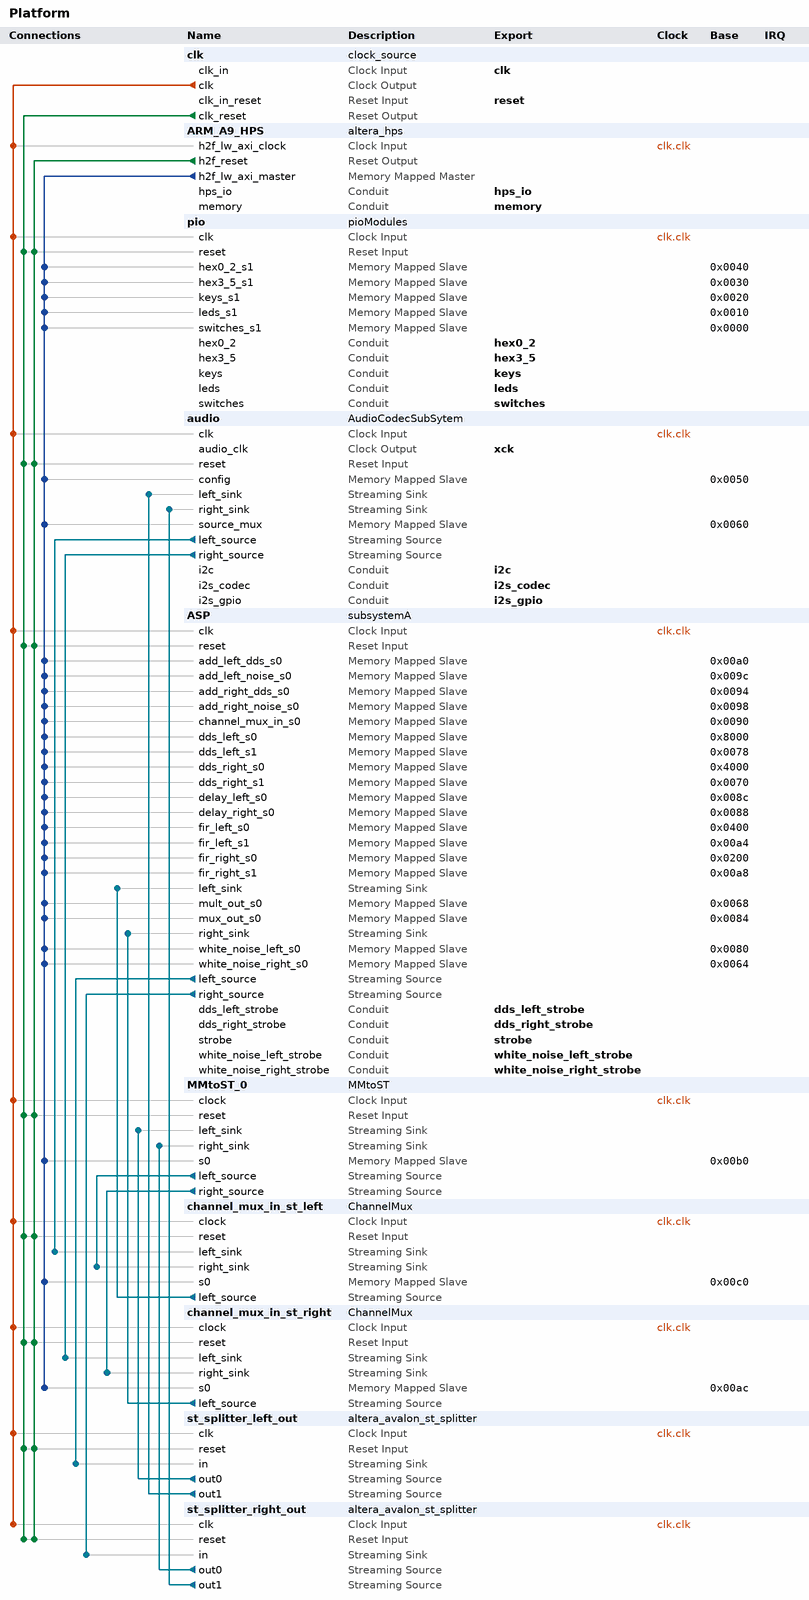
[diagram p0: system contents]
# Platform Designer (Qsys) system Platform, Cyclone V 5CSEMA5F31C6
# Parameters at their usual value, and those the tool derives, are not listed.
package require -exact qsys 17.1
create_system Platform
set_project_property DEVICE_FAMILY {Cyclone V}
set_project_property DEVICE 5CSEMA5F31C6

add_instance clk clock_source 17.1
set_instance_parameter_value clk clockFrequency 50000000

add_instance ARM_A9_HPS altera_hps 17.1
set_instance_parameter_value ARM_A9_HPS EMAC1_Mode RGMII
set_instance_parameter_value ARM_A9_HPS EMAC1_PinMuxing {HPS I/O Set 0}
set_instance_parameter_value ARM_A9_HPS F2SCLK_COLDRST_Enable false
set_instance_parameter_value ARM_A9_HPS F2SCLK_DBGRST_Enable false
set_instance_parameter_value ARM_A9_HPS F2SCLK_WARMRST_Enable false
set_instance_parameter_value ARM_A9_HPS F2SINTERRUPT_Enable false
set_instance_parameter_value ARM_A9_HPS F2S_Width 0
set_instance_parameter_value ARM_A9_HPS FPGA_PERIPHERAL_OUTPUT_CLOCK_FREQ_EMAC0_GTX_CLK 125
set_instance_parameter_value ARM_A9_HPS FPGA_PERIPHERAL_OUTPUT_CLOCK_FREQ_EMAC0_MD_CLK 2.5
set_instance_parameter_value ARM_A9_HPS FPGA_PERIPHERAL_OUTPUT_CLOCK_FREQ_EMAC1_GTX_CLK 125
set_instance_parameter_value ARM_A9_HPS FPGA_PERIPHERAL_OUTPUT_CLOCK_FREQ_EMAC1_MD_CLK 2.5
set_instance_parameter_value ARM_A9_HPS HPS_PROTOCOL DDR3
set_instance_parameter_value ARM_A9_HPS I2C0_Mode I2C
set_instance_parameter_value ARM_A9_HPS I2C0_PinMuxing {HPS I/O Set 0}
set_instance_parameter_value ARM_A9_HPS I2C1_Mode I2C
set_instance_parameter_value ARM_A9_HPS I2C1_PinMuxing {HPS I/O Set 0}
set_instance_parameter_value ARM_A9_HPS LWH2F_Enable true
set_instance_parameter_value ARM_A9_HPS MEM_BANKADDR_WIDTH 3
set_instance_parameter_value ARM_A9_HPS MEM_CLK_FREQ 400.0
set_instance_parameter_value ARM_A9_HPS MEM_COL_ADDR_WIDTH 10
set_instance_parameter_value ARM_A9_HPS MEM_DQ_WIDTH 32
set_instance_parameter_value ARM_A9_HPS MEM_DRV_STR RZQ/7
set_instance_parameter_value ARM_A9_HPS MEM_ROW_ADDR_WIDTH 15
set_instance_parameter_value ARM_A9_HPS MEM_RTT_NOM RZQ/4
set_instance_parameter_value ARM_A9_HPS MEM_RTT_WR RZQ/4
set_instance_parameter_value ARM_A9_HPS MEM_TCL 11
set_instance_parameter_value ARM_A9_HPS MEM_TFAW_NS 30.0
set_instance_parameter_value ARM_A9_HPS MEM_TRAS_NS 35.0
set_instance_parameter_value ARM_A9_HPS MEM_TRCD_NS 13.75
set_instance_parameter_value ARM_A9_HPS MEM_TRFC_NS 260.0
set_instance_parameter_value ARM_A9_HPS MEM_TRP_NS 13.75
set_instance_parameter_value ARM_A9_HPS MEM_VENDOR JEDEC
set_instance_parameter_value ARM_A9_HPS MEM_WTCL 8
set_instance_parameter_value ARM_A9_HPS QSPI_Mode {1 SS}
set_instance_parameter_value ARM_A9_HPS QSPI_PinMuxing {HPS I/O Set 0}
set_instance_parameter_value ARM_A9_HPS REF_CLK_FREQ 25.0
set_instance_parameter_value ARM_A9_HPS S2FCLK_USER2CLK 5
set_instance_parameter_value ARM_A9_HPS S2F_Width 0
set_instance_parameter_value ARM_A9_HPS SDIO_Mode {4-bit Data}
set_instance_parameter_value ARM_A9_HPS SDIO_PinMuxing {HPS I/O Set 0}
set_instance_parameter_value ARM_A9_HPS SPIM1_Mode {Single Slave Select}
set_instance_parameter_value ARM_A9_HPS SPIM1_PinMuxing {HPS I/O Set 0}
set_instance_parameter_value ARM_A9_HPS STM_Enable false
set_instance_parameter_value ARM_A9_HPS TIMING_BOARD_AC_SKEW 0.03
set_instance_parameter_value ARM_A9_HPS TIMING_BOARD_AC_TO_CK_SKEW 0.0
set_instance_parameter_value ARM_A9_HPS TIMING_BOARD_DQ_TO_DQS_SKEW 0.0
set_instance_parameter_value ARM_A9_HPS TIMING_BOARD_MAX_CK_DELAY 0.3
set_instance_parameter_value ARM_A9_HPS TIMING_BOARD_MAX_DQS_DELAY 0.02
set_instance_parameter_value ARM_A9_HPS TIMING_BOARD_SKEW_BETWEEN_DQS 0.08
set_instance_parameter_value ARM_A9_HPS TIMING_BOARD_SKEW_CKDQS_DIMM_MAX 0.16
set_instance_parameter_value ARM_A9_HPS TIMING_BOARD_SKEW_CKDQS_DIMM_MIN 0.09
set_instance_parameter_value ARM_A9_HPS TIMING_BOARD_SKEW_WITHIN_DQS 0.01
set_instance_parameter_value ARM_A9_HPS TIMING_TDH 65
set_instance_parameter_value ARM_A9_HPS TIMING_TDQSCK 255
set_instance_parameter_value ARM_A9_HPS TIMING_TDQSQ 125
set_instance_parameter_value ARM_A9_HPS TIMING_TDS 30
set_instance_parameter_value ARM_A9_HPS TIMING_TIH 140
set_instance_parameter_value ARM_A9_HPS TIMING_TIS 180
set_instance_parameter_value ARM_A9_HPS TIMING_TQSH 0.4
set_instance_parameter_value ARM_A9_HPS UART0_Mode {No Flow Control}
set_instance_parameter_value ARM_A9_HPS UART0_PinMuxing {HPS I/O Set 0}
set_instance_parameter_value ARM_A9_HPS USB1_Mode SDR
set_instance_parameter_value ARM_A9_HPS USB1_PinMuxing {HPS I/O Set 0}
set_instance_parameter_value ARM_A9_HPS desired_cfg_clk_mhz 100.0
set_instance_parameter_value ARM_A9_HPS desired_qspi_clk_mhz 400.0
set_instance_parameter_value ARM_A9_HPS use_default_mpu_clk false

add_instance pio pioModules 1.0

add_instance audio AudioCodecSubSytem 1.0

add_instance ASP subsystemA 1.0

add_instance MMtoST_0 MMtoST 1.0
set_instance_parameter_value MMtoST_0 data_width_g 24
set_instance_parameter_value MMtoST_0 fifo_adr_width_g 8
set_instance_parameter_value MMtoST_0 fifo_depth_g 128

add_instance channel_mux_in_st_left ChannelMux 1.0
set_instance_parameter_value channel_mux_in_st_left gDataWidth 24

add_instance channel_mux_in_st_right ChannelMux 1.0
set_instance_parameter_value channel_mux_in_st_right gDataWidth 24

add_instance st_splitter_left_out altera_avalon_st_splitter 17.1
set_instance_parameter_value st_splitter_left_out BITS_PER_SYMBOL 8
set_instance_parameter_value st_splitter_left_out CHANNEL_WIDTH 1
set_instance_parameter_value st_splitter_left_out DATA_WIDTH 24
set_instance_parameter_value st_splitter_left_out ERROR_WIDTH 1
set_instance_parameter_value st_splitter_left_out MAX_CHANNELS 1
set_instance_parameter_value st_splitter_left_out NUMBER_OF_OUTPUTS 2
set_instance_parameter_value st_splitter_left_out QUALIFY_VALID_OUT 0
set_instance_parameter_value st_splitter_left_out READY_LATENCY 0
set_instance_parameter_value st_splitter_left_out USE_CHANNEL 0
set_instance_parameter_value st_splitter_left_out USE_DATA 1
set_instance_parameter_value st_splitter_left_out USE_ERROR 0
set_instance_parameter_value st_splitter_left_out USE_PACKETS 0
set_instance_parameter_value st_splitter_left_out USE_READY 0
set_instance_parameter_value st_splitter_left_out USE_VALID 1

add_instance st_splitter_right_out altera_avalon_st_splitter 17.1
set_instance_parameter_value st_splitter_right_out BITS_PER_SYMBOL 8
set_instance_parameter_value st_splitter_right_out CHANNEL_WIDTH 1
set_instance_parameter_value st_splitter_right_out DATA_WIDTH 24
set_instance_parameter_value st_splitter_right_out ERROR_WIDTH 1
set_instance_parameter_value st_splitter_right_out MAX_CHANNELS 1
set_instance_parameter_value st_splitter_right_out NUMBER_OF_OUTPUTS 2
set_instance_parameter_value st_splitter_right_out QUALIFY_VALID_OUT 0
set_instance_parameter_value st_splitter_right_out READY_LATENCY 0
set_instance_parameter_value st_splitter_right_out USE_CHANNEL 0
set_instance_parameter_value st_splitter_right_out USE_DATA 1
set_instance_parameter_value st_splitter_right_out USE_ERROR 0
set_instance_parameter_value st_splitter_right_out USE_PACKETS 0
set_instance_parameter_value st_splitter_right_out USE_READY 0
set_instance_parameter_value st_splitter_right_out USE_VALID 1

# connections
add_connection clk.clk ARM_A9_HPS.h2f_lw_axi_clock clock
add_connection clk.clk ASP.clk clock
add_connection clk.clk audio.clk clock
add_connection clk.clk channel_mux_in_st_left.clock clock
add_connection clk.clk channel_mux_in_st_right.clock clock
add_connection clk.clk MMtoST_0.clock clock
add_connection clk.clk pio.clk clock
add_connection clk.clk st_splitter_left_out.clk clock
add_connection clk.clk st_splitter_right_out.clk clock
add_connection ARM_A9_HPS.h2f_reset ASP.reset reset
add_connection ARM_A9_HPS.h2f_reset audio.reset reset
add_connection ARM_A9_HPS.h2f_reset channel_mux_in_st_left.reset reset
add_connection ARM_A9_HPS.h2f_reset channel_mux_in_st_right.reset reset
add_connection ARM_A9_HPS.h2f_reset MMtoST_0.reset reset
add_connection ARM_A9_HPS.h2f_reset pio.reset reset
add_connection ARM_A9_HPS.h2f_reset st_splitter_left_out.reset reset
add_connection ARM_A9_HPS.h2f_reset st_splitter_right_out.reset reset
add_connection clk.clk_reset ASP.reset reset
add_connection clk.clk_reset audio.reset reset
add_connection clk.clk_reset channel_mux_in_st_left.reset reset
add_connection clk.clk_reset channel_mux_in_st_right.reset reset
add_connection clk.clk_reset MMtoST_0.reset reset
add_connection clk.clk_reset pio.reset reset
add_connection clk.clk_reset st_splitter_left_out.reset reset
add_connection clk.clk_reset st_splitter_right_out.reset reset
add_connection ARM_A9_HPS.h2f_lw_axi_master ASP.add_left_dds_s0 avalon
set_connection_parameter_value ARM_A9_HPS.h2f_lw_axi_master/ASP.add_left_dds_s0 baseAddress 0x00a0
add_connection ARM_A9_HPS.h2f_lw_axi_master ASP.add_left_noise_s0 avalon
set_connection_parameter_value ARM_A9_HPS.h2f_lw_axi_master/ASP.add_left_noise_s0 baseAddress 0x009c
add_connection ARM_A9_HPS.h2f_lw_axi_master ASP.add_right_dds_s0 avalon
set_connection_parameter_value ARM_A9_HPS.h2f_lw_axi_master/ASP.add_right_dds_s0 baseAddress 0x0094
add_connection ARM_A9_HPS.h2f_lw_axi_master ASP.add_right_noise_s0 avalon
set_connection_parameter_value ARM_A9_HPS.h2f_lw_axi_master/ASP.add_right_noise_s0 baseAddress 0x0098
add_connection ARM_A9_HPS.h2f_lw_axi_master ASP.channel_mux_in_s0 avalon
set_connection_parameter_value ARM_A9_HPS.h2f_lw_axi_master/ASP.channel_mux_in_s0 baseAddress 0x0090
add_connection ARM_A9_HPS.h2f_lw_axi_master ASP.dds_left_s0 avalon
set_connection_parameter_value ARM_A9_HPS.h2f_lw_axi_master/ASP.dds_left_s0 baseAddress 0x8000
add_connection ARM_A9_HPS.h2f_lw_axi_master ASP.dds_left_s1 avalon
set_connection_parameter_value ARM_A9_HPS.h2f_lw_axi_master/ASP.dds_left_s1 baseAddress 0x0078
add_connection ARM_A9_HPS.h2f_lw_axi_master ASP.dds_right_s0 avalon
set_connection_parameter_value ARM_A9_HPS.h2f_lw_axi_master/ASP.dds_right_s0 baseAddress 0x4000
add_connection ARM_A9_HPS.h2f_lw_axi_master ASP.dds_right_s1 avalon
set_connection_parameter_value ARM_A9_HPS.h2f_lw_axi_master/ASP.dds_right_s1 baseAddress 0x0070
add_connection ARM_A9_HPS.h2f_lw_axi_master ASP.delay_left_s0 avalon
set_connection_parameter_value ARM_A9_HPS.h2f_lw_axi_master/ASP.delay_left_s0 baseAddress 0x008c
add_connection ARM_A9_HPS.h2f_lw_axi_master ASP.delay_right_s0 avalon
set_connection_parameter_value ARM_A9_HPS.h2f_lw_axi_master/ASP.delay_right_s0 baseAddress 0x0088
add_connection ARM_A9_HPS.h2f_lw_axi_master ASP.fir_left_s0 avalon
set_connection_parameter_value ARM_A9_HPS.h2f_lw_axi_master/ASP.fir_left_s0 baseAddress 0x0400
add_connection ARM_A9_HPS.h2f_lw_axi_master ASP.fir_left_s1 avalon
set_connection_parameter_value ARM_A9_HPS.h2f_lw_axi_master/ASP.fir_left_s1 baseAddress 0x00a4
add_connection ARM_A9_HPS.h2f_lw_axi_master ASP.fir_right_s0 avalon
set_connection_parameter_value ARM_A9_HPS.h2f_lw_axi_master/ASP.fir_right_s0 baseAddress 0x0200
add_connection ARM_A9_HPS.h2f_lw_axi_master ASP.fir_right_s1 avalon
set_connection_parameter_value ARM_A9_HPS.h2f_lw_axi_master/ASP.fir_right_s1 baseAddress 0x00a8
add_connection ARM_A9_HPS.h2f_lw_axi_master ASP.mult_out_s0 avalon
set_connection_parameter_value ARM_A9_HPS.h2f_lw_axi_master/ASP.mult_out_s0 baseAddress 0x0068
add_connection ARM_A9_HPS.h2f_lw_axi_master ASP.mux_out_s0 avalon
set_connection_parameter_value ARM_A9_HPS.h2f_lw_axi_master/ASP.mux_out_s0 baseAddress 0x0084
add_connection ARM_A9_HPS.h2f_lw_axi_master ASP.white_noise_left_s0 avalon
set_connection_parameter_value ARM_A9_HPS.h2f_lw_axi_master/ASP.white_noise_left_s0 baseAddress 0x0080
add_connection ARM_A9_HPS.h2f_lw_axi_master ASP.white_noise_right_s0 avalon
set_connection_parameter_value ARM_A9_HPS.h2f_lw_axi_master/ASP.white_noise_right_s0 baseAddress 0x0064
add_connection ARM_A9_HPS.h2f_lw_axi_master audio.config avalon
set_connection_parameter_value ARM_A9_HPS.h2f_lw_axi_master/audio.config baseAddress 0x0050
add_connection ARM_A9_HPS.h2f_lw_axi_master audio.source_mux avalon
set_connection_parameter_value ARM_A9_HPS.h2f_lw_axi_master/audio.source_mux baseAddress 0x0060
add_connection ARM_A9_HPS.h2f_lw_axi_master channel_mux_in_st_left.s0 avalon
set_connection_parameter_value ARM_A9_HPS.h2f_lw_axi_master/channel_mux_in_st_left.s0 baseAddress 0x00c0
add_connection ARM_A9_HPS.h2f_lw_axi_master channel_mux_in_st_right.s0 avalon
set_connection_parameter_value ARM_A9_HPS.h2f_lw_axi_master/channel_mux_in_st_right.s0 baseAddress 0x00ac
add_connection ARM_A9_HPS.h2f_lw_axi_master MMtoST_0.s0 avalon
set_connection_parameter_value ARM_A9_HPS.h2f_lw_axi_master/MMtoST_0.s0 baseAddress 0x00b0
add_connection ARM_A9_HPS.h2f_lw_axi_master pio.hex0_2_s1 avalon
set_connection_parameter_value ARM_A9_HPS.h2f_lw_axi_master/pio.hex0_2_s1 baseAddress 0x0040
add_connection ARM_A9_HPS.h2f_lw_axi_master pio.hex3_5_s1 avalon
set_connection_parameter_value ARM_A9_HPS.h2f_lw_axi_master/pio.hex3_5_s1 baseAddress 0x0030
add_connection ARM_A9_HPS.h2f_lw_axi_master pio.keys_s1 avalon
set_connection_parameter_value ARM_A9_HPS.h2f_lw_axi_master/pio.keys_s1 baseAddress 0x0020
add_connection ARM_A9_HPS.h2f_lw_axi_master pio.leds_s1 avalon
set_connection_parameter_value ARM_A9_HPS.h2f_lw_axi_master/pio.leds_s1 baseAddress 0x0010
add_connection ARM_A9_HPS.h2f_lw_axi_master pio.switches_s1 avalon
set_connection_parameter_value ARM_A9_HPS.h2f_lw_axi_master/pio.switches_s1 baseAddress 0x0000
add_connection ASP.left_source st_splitter_left_out.in avalon_streaming
add_connection ASP.right_source st_splitter_right_out.in avalon_streaming
add_connection audio.left_source channel_mux_in_st_left.left_sink avalon_streaming
add_connection audio.right_source channel_mux_in_st_right.left_sink avalon_streaming
add_connection channel_mux_in_st_left.left_source ASP.left_sink avalon_streaming
add_connection channel_mux_in_st_right.left_source ASP.right_sink avalon_streaming
add_connection MMtoST_0.left_source channel_mux_in_st_left.right_sink avalon_streaming
add_connection MMtoST_0.right_source channel_mux_in_st_right.right_sink avalon_streaming
add_connection st_splitter_left_out.out0 MMtoST_0.left_sink avalon_streaming
add_connection st_splitter_left_out.out1 audio.left_sink avalon_streaming
add_connection st_splitter_right_out.out0 MMtoST_0.right_sink avalon_streaming
add_connection st_splitter_right_out.out1 audio.right_sink avalon_streaming

# exported interfaces
add_interface clk clock sink
set_interface_property clk EXPORT_OF clk.clk_in
add_interface dds_left_strobe conduit end
set_interface_property dds_left_strobe EXPORT_OF ASP.dds_left_strobe
add_interface dds_right_strobe conduit end
set_interface_property dds_right_strobe EXPORT_OF ASP.dds_right_strobe
add_interface hex0_2 conduit end
set_interface_property hex0_2 EXPORT_OF pio.hex0_2
add_interface hex3_5 conduit end
set_interface_property hex3_5 EXPORT_OF pio.hex3_5
add_interface hps_io conduit end
set_interface_property hps_io EXPORT_OF ARM_A9_HPS.hps_io
add_interface i2c conduit end
set_interface_property i2c EXPORT_OF audio.i2c
add_interface i2s_codec conduit end
set_interface_property i2s_codec EXPORT_OF audio.i2s_codec
add_interface i2s_gpio conduit end
set_interface_property i2s_gpio EXPORT_OF audio.i2s_gpio
add_interface keys conduit end
set_interface_property keys EXPORT_OF pio.keys
add_interface leds conduit end
set_interface_property leds EXPORT_OF pio.leds
add_interface memory conduit end
set_interface_property memory EXPORT_OF ARM_A9_HPS.memory
add_interface reset reset sink
set_interface_property reset EXPORT_OF clk.clk_in_reset
add_interface strobe conduit end
set_interface_property strobe EXPORT_OF ASP.strobe
add_interface switches conduit end
set_interface_property switches EXPORT_OF pio.switches
add_interface white_noise_left_strobe conduit end
set_interface_property white_noise_left_strobe EXPORT_OF ASP.white_noise_left_strobe
add_interface white_noise_right_strobe conduit end
set_interface_property white_noise_right_strobe EXPORT_OF ASP.white_noise_right_strobe
add_interface xck clock source
set_interface_property xck EXPORT_OF audio.audio_clk

set_interconnect_requirement {$system} qsys_mm.clockCrossingAdapter HANDSHAKE
set_interconnect_requirement {$system} qsys_mm.enableEccProtection FALSE
set_interconnect_requirement {$system} qsys_mm.insertDefaultSlave FALSE
set_interconnect_requirement {$system} qsys_mm.maxAdditionalLatency 1

save_system Platform.qsys
